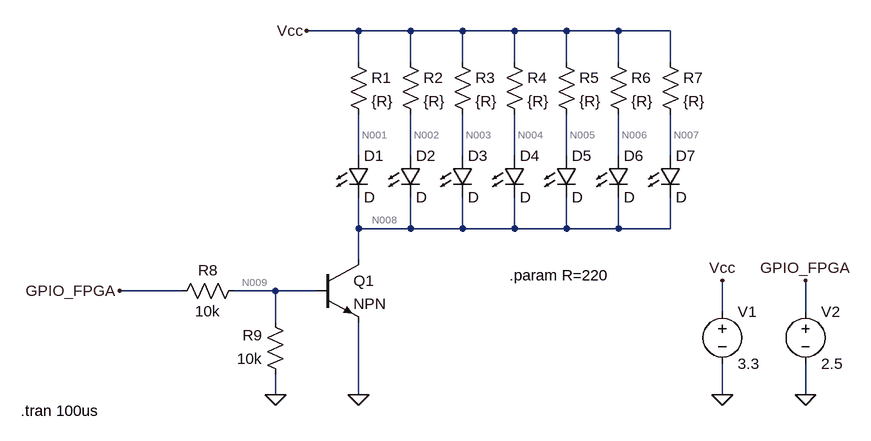
[diagram p0: schematic TD62504P_test.asc]
TD62504P_test.asc, the LTspice schematic file:
Version 4
SHEET 1 960 680
WIRE 208 -256 128 -256
WIRE 288 -256 208 -256
WIRE 368 -256 288 -256
WIRE 448 -256 368 -256
WIRE 528 -256 448 -256
WIRE 608 -256 528 -256
WIRE 688 -256 608 -256
WIRE 208 -208 208 -256
WIRE 288 -208 288 -256
WIRE 368 -208 368 -256
WIRE 448 -208 448 -256
WIRE 528 -208 528 -256
WIRE 608 -208 608 -256
WIRE 688 -208 688 -256
WIRE 208 -64 208 -128
WIRE 288 -64 288 -128
WIRE 368 -64 368 -128
WIRE 448 -64 448 -128
WIRE 528 -64 528 -128
WIRE 608 -64 608 -128
WIRE 688 -64 688 -128
WIRE 208 48 208 0
WIRE 288 48 288 0
WIRE 288 48 208 48
WIRE 368 48 368 0
WIRE 368 48 288 48
WIRE 448 48 448 0
WIRE 448 48 368 48
WIRE 528 48 528 0
WIRE 528 48 448 48
WIRE 608 48 608 0
WIRE 608 48 528 48
WIRE 688 48 688 0
WIRE 688 48 608 48
WIRE 208 96 208 48
WIRE -64 144 -160 144
WIRE 80 144 16 144
WIRE 144 144 80 144
WIRE 768 176 768 128
WIRE 896 176 896 128
WIRE 80 192 80 144
WIRE 80 304 80 272
WIRE 208 304 208 192
WIRE 768 304 768 256
WIRE 896 304 896 256
FLAG 208 304 0
FLAG 80 304 0
FLAG -160 144 GPIO_FPGA
FLAG 128 -256 Vcc
FLAG 768 304 0
FLAG 768 128 Vcc
FLAG 896 304 0
FLAG 896 128 GPIO_FPGA
SYMBOL npn 144 96 R0
SYMATTR InstName Q1
SYMBOL LED 192 -64 R0
SYMATTR InstName D1
SYMBOL LED 272 -64 R0
SYMATTR InstName D2
SYMBOL LED 352 -64 R0
SYMATTR InstName D3
SYMBOL LED 432 -64 R0
SYMATTR InstName D4
SYMBOL LED 512 -64 R0
SYMATTR InstName D5
SYMBOL LED 592 -64 R0
SYMATTR InstName D6
SYMBOL LED 672 -64 R0
SYMATTR InstName D7
SYMBOL res 192 -224 R0
SYMATTR InstName R1
SYMATTR Value {R}
SYMBOL res 272 -224 R0
SYMATTR InstName R2
SYMATTR Value {R}
SYMBOL res 352 -224 R0
SYMATTR InstName R3
SYMATTR Value {R}
SYMBOL res 432 -224 R0
SYMATTR InstName R4
SYMATTR Value {R}
SYMBOL res 512 -224 R0
SYMATTR InstName R5
SYMATTR Value {R}
SYMBOL res 592 -224 R0
SYMATTR InstName R6
SYMATTR Value {R}
SYMBOL res 672 -224 R0
SYMATTR InstName R7
SYMATTR Value {R}
SYMBOL res 32 128 R90
WINDOW 0 0 56 VBottom 2
WINDOW 3 32 56 VTop 2
SYMATTR InstName R8
SYMATTR Value 10k
SYMBOL res 96 288 R180
WINDOW 0 36 76 Left 2
WINDOW 3 36 40 Left 2
SYMATTR InstName R9
SYMATTR Value 10k
SYMBOL voltage 768 160 R0
WINDOW 123 0 0 Left 0
WINDOW 39 0 0 Left 0
SYMATTR InstName V1
SYMATTR Value 3.3
SYMBOL voltage 896 160 R0
WINDOW 123 0 0 Left 0
WINDOW 39 0 0 Left 0
SYMATTR InstName V2
SYMATTR Value 2.5
TEXT 440 120 Left 2 !.param R=220
TEXT -312 328 Left 2 !.tran 100us

The netlist it stands for:
* TD62504P_test.asc
Q1 N008 N009 0 0 NPN
D1 N001 N008 D
D2 N002 N008 D
D3 N003 N008 D
D4 N004 N008 D
D5 N005 N008 D
D6 N006 N008 D
D7 N007 N008 D
R1 Vcc N001 {R}
R2 Vcc N002 {R}
R3 Vcc N003 {R}
R4 Vcc N004 {R}
R5 Vcc N005 {R}
R6 Vcc N006 {R}
R7 Vcc N007 {R}
R8 N009 GPIO_FPGA 10k
R9 0 N009 10k
V1 Vcc 0 3.3
V2 GPIO_FPGA 0 2.5
.model D D
.lib standard.dio
.model NPN NPN
.model PNP PNP
.lib standard.bjt
.param R=220
.tran 100us
.backanno
.end

* Results of the author's LTspice run, read from the files saved beside the schematic
* Operating Point, zero values left out:
*   V(n008) = 2.376 V
*   V(n009) = 829.3 mV
*   V(n001) = 3.036 V
*   V(n002) = 3.036 V
*   V(n003) = 3.036 V
*   V(n004) = 3.036 V
*   V(n005) = 3.036 V
*   V(n006) = 3.036 V
*   V(n007) = 3.036 V
*   V(vcc) = 3.3 V
*   V(gpio_fpga) = 2.5 V
*   Ic(Q1) = 8.414 mA
*   Ib(Q1) = 84.14 µA
*   Ie(Q1) = -8.498 mA
*   I(D7) = 1.202 mA
*   I(D6) = 1.202 mA
*   I(D5) = 1.202 mA
*   I(D4) = 1.202 mA
*   I(D3) = 1.202 mA
*   I(D2) = 1.202 mA
*   I(D1) = 1.202 mA
*   I(R9) = -82.93 µA
*   I(R8) = -167.1 µA
*   I(R7) = 1.202 mA
*   I(R6) = 1.202 mA
*   I(R5) = 1.202 mA
*   I(R4) = 1.202 mA
*   I(R3) = 1.202 mA
*   I(R2) = 1.202 mA
*   I(R1) = 1.202 mA
*   I(V2) = -167.1 µA
*   I(V1) = -8.414 mA